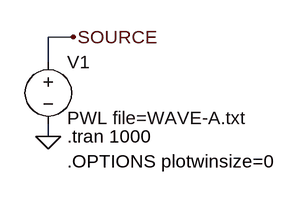
[diagram p0: schematic Fig_2-41_V-source-PWL_TXT.asc]
Fig_2-41_V-source-PWL_TXT.asc, the LTspice schematic file:
Version 4
SHEET 1 880 680
WIRE 144 80 112 80
WIRE 112 112 112 80
WIRE 112 208 112 192
FLAG 112 208 0
FLAG 144 80 SOURCE
SYMBOL voltage 112 96 R0
WINDOW 3 24 88 Left 2
WINDOW 123 0 0 Left 2
WINDOW 39 0 0 Left 2
SYMATTR Value PWL file=WAVE-A.txt
SYMATTR InstName V1
TEXT 136 208 Left 2 !.tran 1000
TEXT 136 240 Left 2 !.OPTIONS plotwinsize=0

The netlist it stands for:
* Fig_2-41_V-source-PWL_TXT.asc
V1 SOURCE 0 PWL file=WAVE-A.txt
.tran 1000
.OPTIONS plotwinsize=0
.backanno
.end